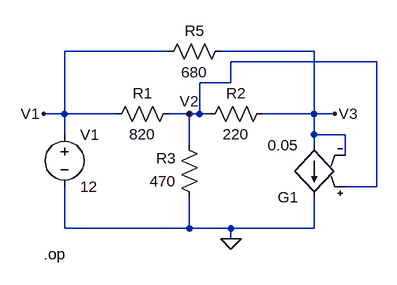
[diagram p0: schematic nodal6.asc]
nodal6.asc, the LTspice schematic file:
Version 4
SHEET 1 880 680
WIRE 144 16 -16 16
WIRE 368 16 224 16
WIRE 464 32 240 32
WIRE 240 64 240 32
WIRE 240 64 192 64
WIRE -16 112 -16 16
WIRE -16 112 -48 112
WIRE 64 112 -16 112
WIRE 176 112 144 112
WIRE 192 112 192 64
WIRE 192 112 176 112
WIRE 208 112 192 112
WIRE 368 112 368 16
WIRE 368 112 288 112
WIRE 400 112 368 112
WIRE -16 144 -16 112
WIRE 368 144 368 112
WIRE 416 144 368 144
WIRE 176 160 176 112
WIRE 368 160 368 144
WIRE 416 176 416 144
WIRE 464 224 464 32
WIRE 464 224 416 224
WIRE -16 288 -16 224
WIRE 176 288 176 240
WIRE 176 288 -16 288
WIRE 240 288 176 288
WIRE 368 288 368 240
WIRE 368 288 240 288
WIRE 240 304 240 288
FLAG 176 112 V2
FLAG 400 112 V3
FLAG 240 304 0
FLAG -48 112 V1
SYMBOL res 160 96 R90
WINDOW 0 0 56 VBottom 2
WINDOW 3 32 56 VTop 2
SYMATTR InstName R1
SYMATTR Value 820
SYMBOL res 192 256 R180
WINDOW 0 36 76 Left 2
WINDOW 3 36 40 Left 2
SYMATTR InstName R3
SYMATTR Value 470
SYMBOL res 128 32 R270
WINDOW 0 32 56 VTop 2
WINDOW 3 0 56 VBottom 2
SYMATTR InstName R5
SYMATTR Value 680
SYMBOL res 304 96 R90
WINDOW 0 0 56 VBottom 2
WINDOW 3 32 56 VTop 2
SYMATTR InstName R2
SYMATTR Value 220
SYMBOL g 368 256 R180
SYMATTR InstName G1
SYMATTR Value 0.05
SYMBOL voltage -16 128 R0
WINDOW 123 0 0 Left 0
WINDOW 39 0 0 Left 0
SYMATTR InstName V1
SYMATTR Value 12
TEXT -48 328 Left 2 !.op

The netlist it stands for:
* nodal6.asc
R1 V2 V1 820
R3 0 V2 470
R5 V1 V3 680
R2 V3 V2 220
G1 V3 0 V2 V3 0.05
V1 V1 0 12
.op
.backanno
.end

* Results of the author's LTspice run, read from the files saved beside the schematic
* Operating Point:
*   V(v2) = 4.009 V
*   V(v1) = 12 V
*   V(v3) = 3.742 V
*   I(R2) = -1.214 mA
*   I(R5) = 12.14 mA
*   I(R3) = -8.53 mA
*   I(R1) = -9.745 mA
*   I(G1) = 13.36 mA
*   I(V1) = -21.89 mA